# EAGLE schematic keyboardDesignV1 (EAGLE 9.3.2)
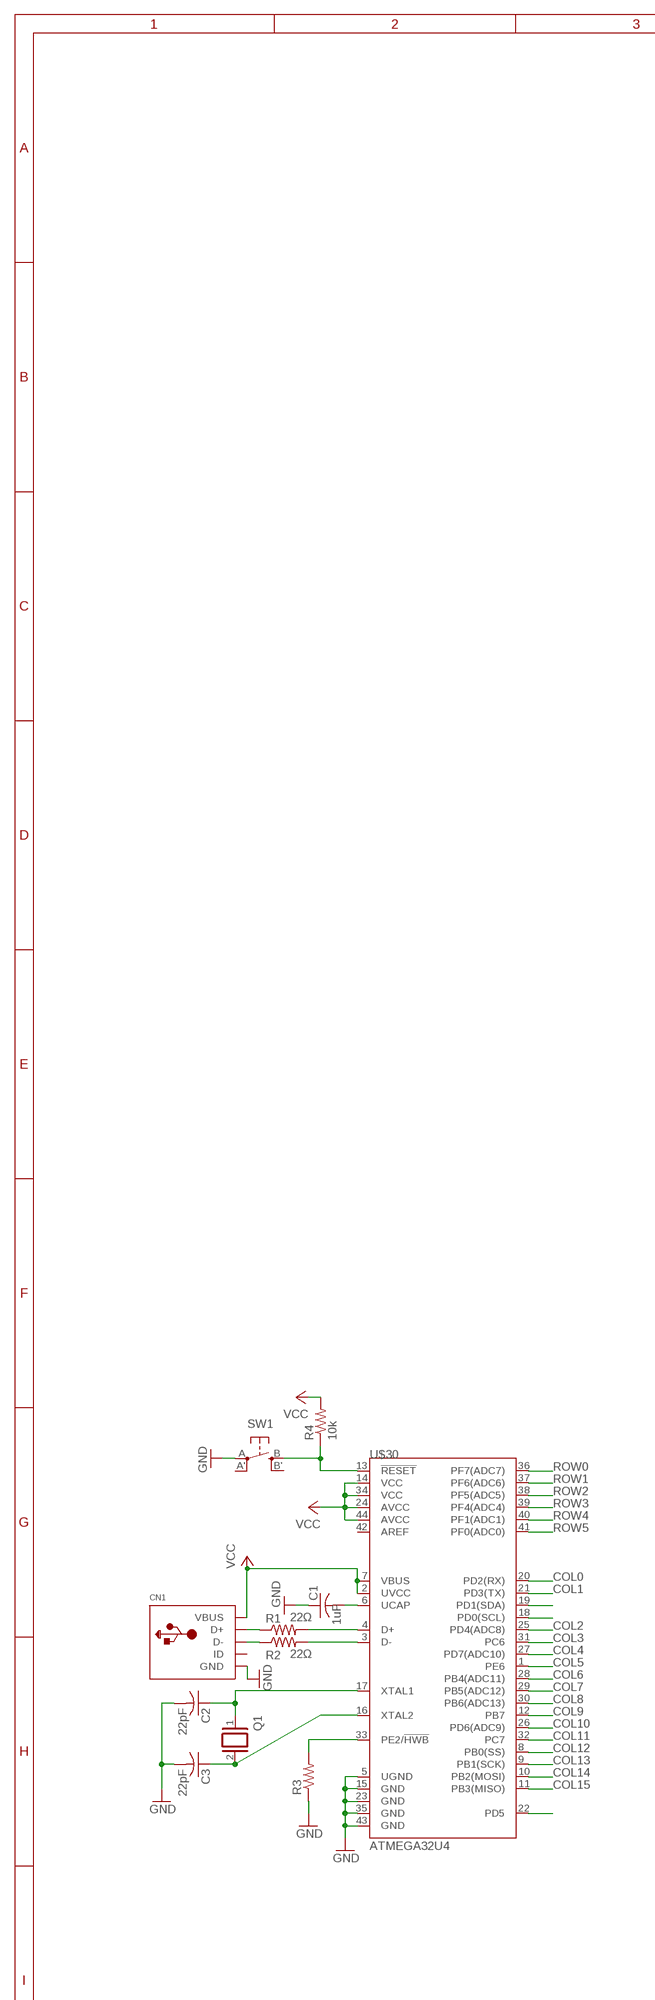
[diagram p0: schematic, sheet 1, part 1 of 2]
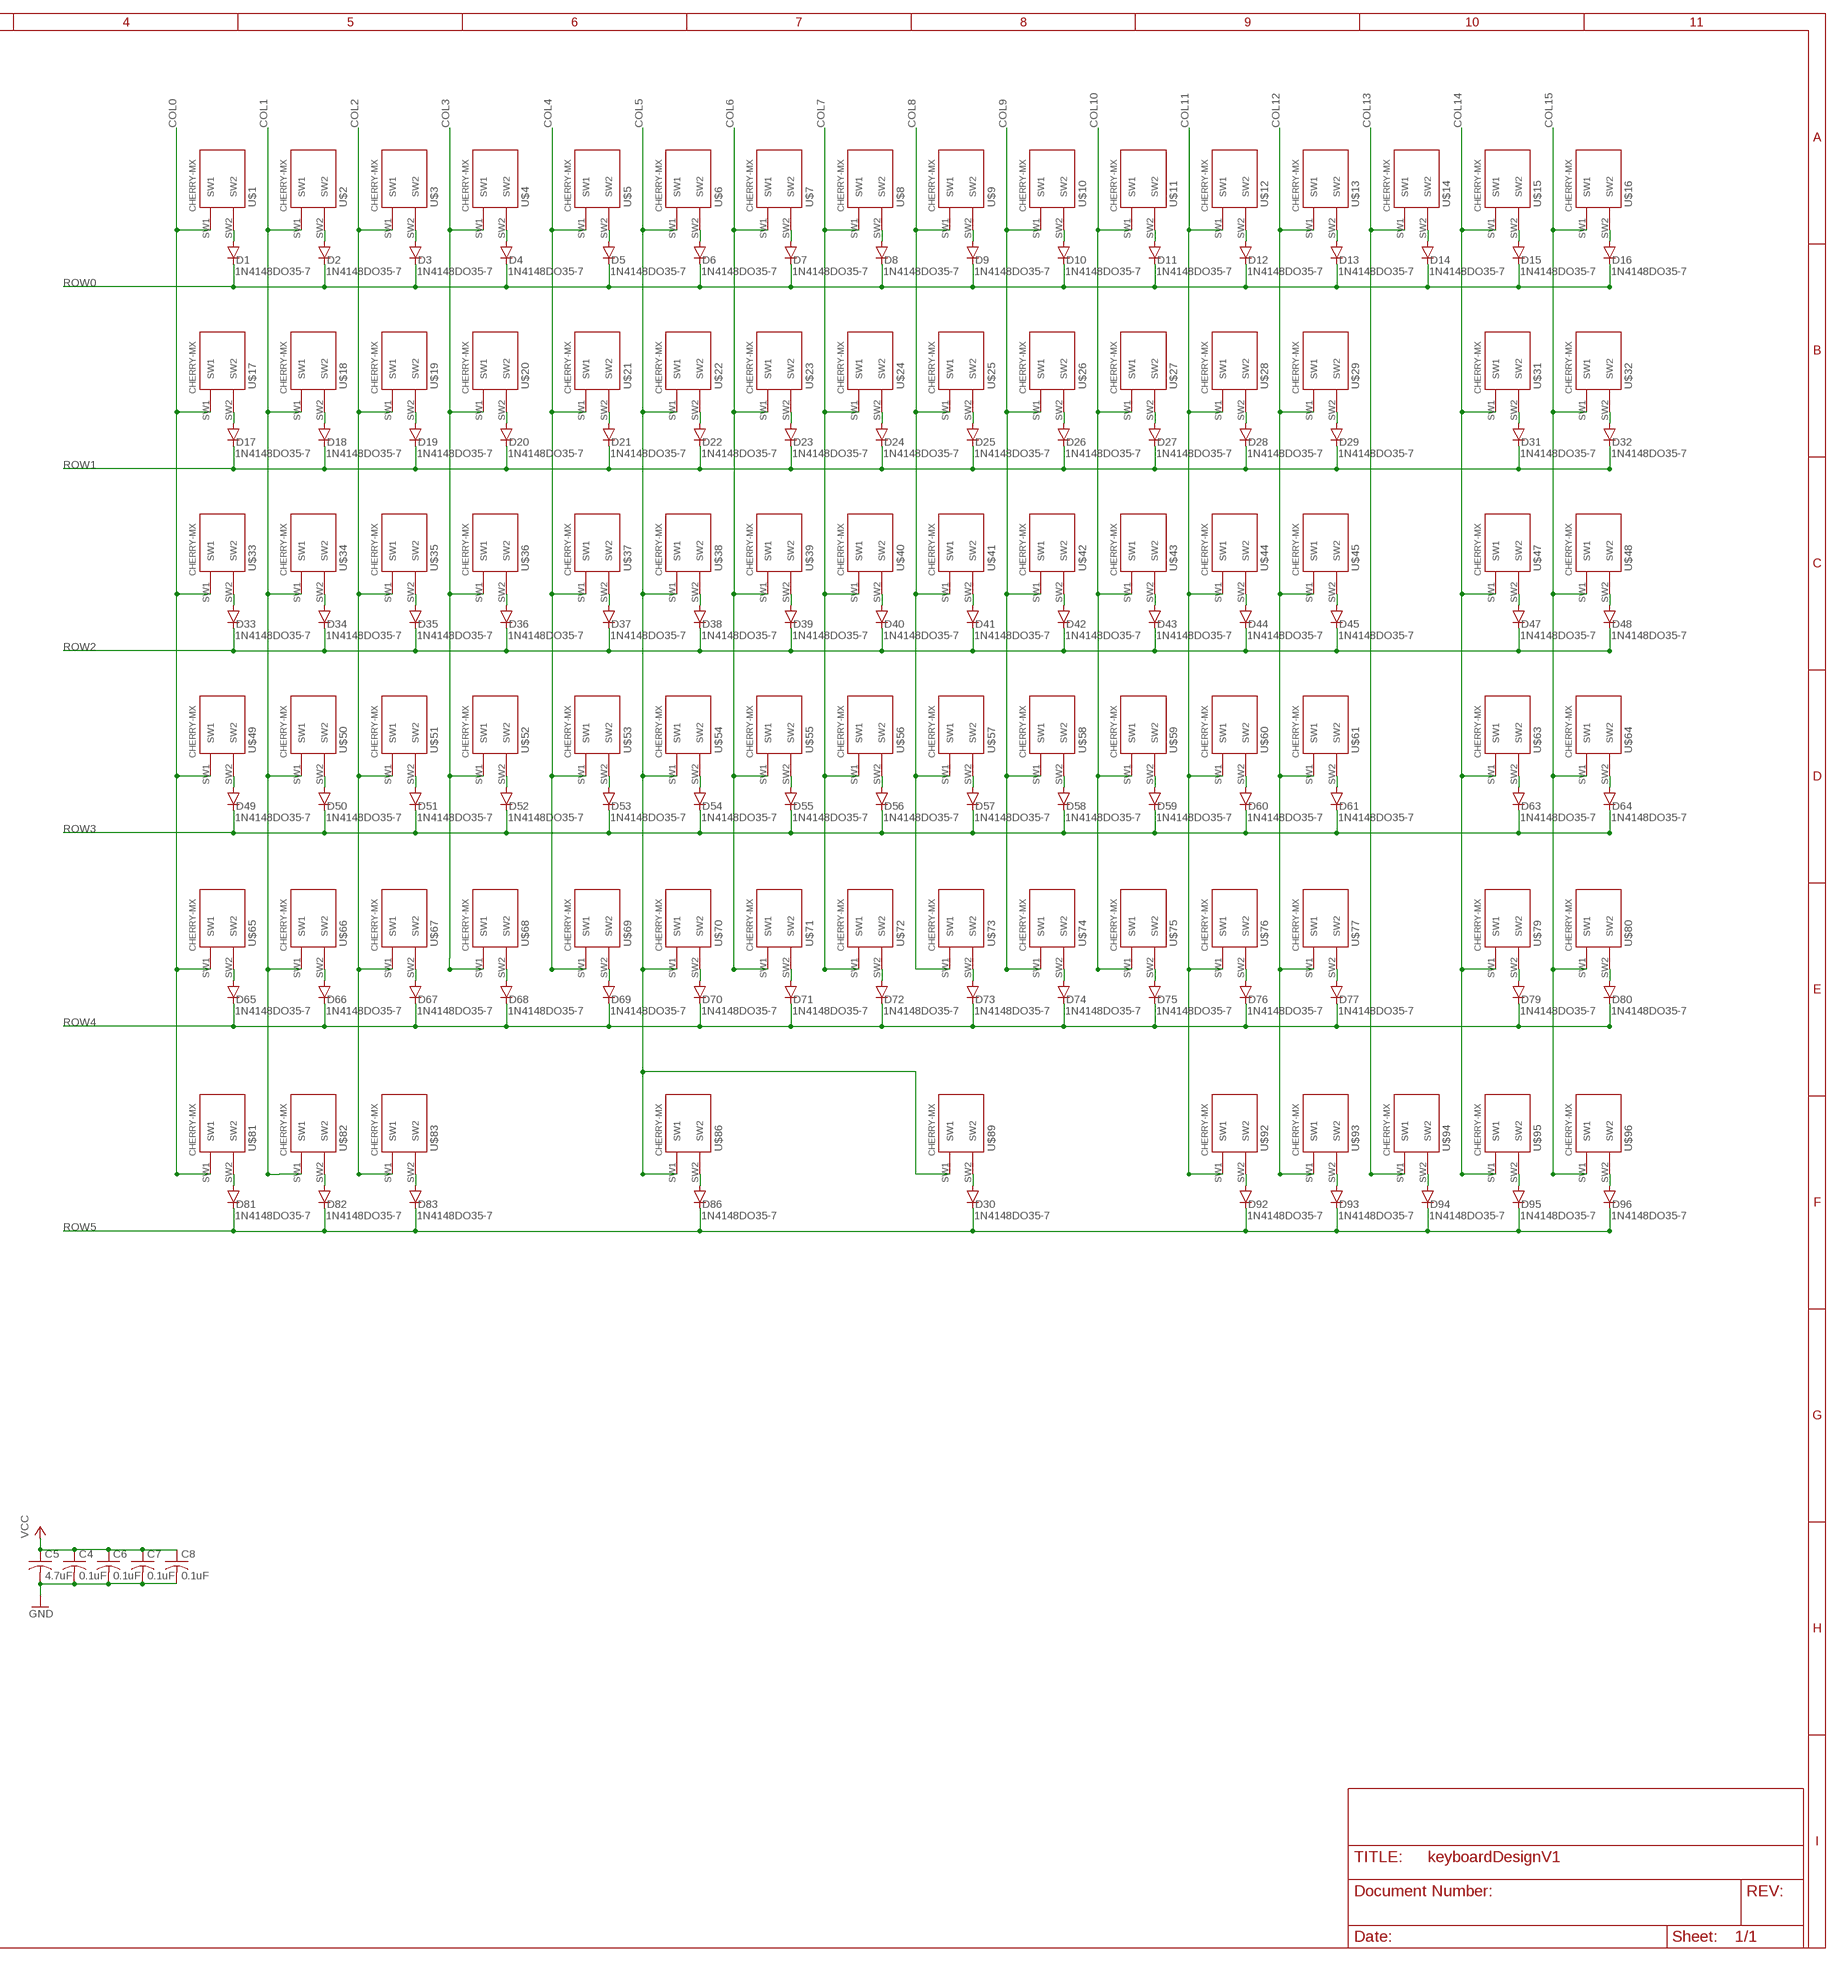
[diagram p1: schematic, sheet 1, part 2 of 2]

## Parts
C1  1uF  C-US025-025X050  [C025-025X050]
C2  22pF  C-US025-025X050  [C025-025X050]
C3  22pF  C-US025-025X050  [C025-025X050]
C4  0.1uF  C-US025-025X050  [C025-025X050]
C5  4.7uF  C-US025-025X050  [C025-025X050]
C6  0.1uF  C-US025-025X050  [C025-025X050]
C7  0.1uF  C-US025-025X050  [C025-025X050]
C8  0.1uF  C-US025-025X050  [C025-025X050]
CN1  USBTHM  [USB-MINIB-THM]
D1  1N4148DO35-7  [DO35-7]
D2  1N4148DO35-7  [DO35-7]
D3  1N4148DO35-7  [DO35-7]
D4  1N4148DO35-7  [DO35-7]
D5  1N4148DO35-7  [DO35-7]
D6  1N4148DO35-7  [DO35-7]
D7  1N4148DO35-7  [DO35-7]
D8  1N4148DO35-7  [DO35-7]
D9  1N4148DO35-7  [DO35-7]
D10  1N4148DO35-7  [DO35-7]
D11  1N4148DO35-7  [DO35-7]
D12  1N4148DO35-7  [DO35-7]
D13  1N4148DO35-7  [DO35-7]
D14  1N4148DO35-7  [DO35-7]
D15  1N4148DO35-7  [DO35-7]
D16  1N4148DO35-7  [DO35-7]
D17  1N4148DO35-7  [DO35-7]
D18  1N4148DO35-7  [DO35-7]
D19  1N4148DO35-7  [DO35-7]
D20  1N4148DO35-7  [DO35-7]
D21  1N4148DO35-7  [DO35-7]
D22  1N4148DO35-7  [DO35-7]
D23  1N4148DO35-7  [DO35-7]
D24  1N4148DO35-7  [DO35-7]
D25  1N4148DO35-7  [DO35-7]
D26  1N4148DO35-7  [DO35-7]
D27  1N4148DO35-7  [DO35-7]
D28  1N4148DO35-7  [DO35-7]
D29  1N4148DO35-7  [DO35-7]
D30  1N4148DO35-7  [DO35-7]
D31  1N4148DO35-7  [DO35-7]
D32  1N4148DO35-7  [DO35-7]
D33  1N4148DO35-7  [DO35-7]
D34  1N4148DO35-7  [DO35-7]
D35  1N4148DO35-7  [DO35-7]
D36  1N4148DO35-7  [DO35-7]
D37  1N4148DO35-7  [DO35-7]
D38  1N4148DO35-7  [DO35-7]
D39  1N4148DO35-7  [DO35-7]
D40  1N4148DO35-7  [DO35-7]
D41  1N4148DO35-7  [DO35-7]
D42  1N4148DO35-7  [DO35-7]
D43  1N4148DO35-7  [DO35-7]
D44  1N4148DO35-7  [DO35-7]
D45  1N4148DO35-7  [DO35-7]
D47  1N4148DO35-7  [DO35-7]
D48  1N4148DO35-7  [DO35-7]
D49  1N4148DO35-7  [DO35-7]
D50  1N4148DO35-7  [DO35-7]
D51  1N4148DO35-7  [DO35-7]
D52  1N4148DO35-7  [DO35-7]
D53  1N4148DO35-7  [DO35-7]
D54  1N4148DO35-7  [DO35-7]
D55  1N4148DO35-7  [DO35-7]
D56  1N4148DO35-7  [DO35-7]
D57  1N4148DO35-7  [DO35-7]
D58  1N4148DO35-7  [DO35-7]
D59  1N4148DO35-7  [DO35-7]
D60  1N4148DO35-7  [DO35-7]
D61  1N4148DO35-7  [DO35-7]
D63  1N4148DO35-7  [DO35-7]
D64  1N4148DO35-7  [DO35-7]
D65  1N4148DO35-7  [DO35-7]
D66  1N4148DO35-7  [DO35-7]
D67  1N4148DO35-7  [DO35-7]
D68  1N4148DO35-7  [DO35-7]
D69  1N4148DO35-7  [DO35-7]
D70  1N4148DO35-7  [DO35-7]
D71  1N4148DO35-7  [DO35-7]
D72  1N4148DO35-7  [DO35-7]
D73  1N4148DO35-7  [DO35-7]
D74  1N4148DO35-7  [DO35-7]
D75  1N4148DO35-7  [DO35-7]
D76  1N4148DO35-7  [DO35-7]
D77  1N4148DO35-7  [DO35-7]
D79  1N4148DO35-7  [DO35-7]
D80  1N4148DO35-7  [DO35-7]
D81  1N4148DO35-7  [DO35-7]
D82  1N4148DO35-7  [DO35-7]
D83  1N4148DO35-7  [DO35-7]
D86  1N4148DO35-7  [DO35-7]
D92  1N4148DO35-7  [DO35-7]
D93  1N4148DO35-7  [DO35-7]
D94  1N4148DO35-7  [DO35-7]
D95  1N4148DO35-7  [DO35-7]
D96  1N4148DO35-7  [DO35-7]
Q1  XTAL/S  [QS]
R1  22Ω  R-US_0204/7  [0204/7]
R2  22Ω  R-US_0204/7  [0204/7]
R3  R-US_0204/7  [0204/7]
R4  10k  R-US_0204/7  [0204/7]
SW1  SPST_TACT-EVQQ2  [EVQ-Q2]
U$1  CHERRY-MXSTANDARD  [CHERRY-MX]
U$2  CHERRY-MXSTANDARD  [CHERRY-MX]
U$3  CHERRY-MXSTANDARD  [CHERRY-MX]
U$4  CHERRY-MXSTANDARD  [CHERRY-MX]
U$5  CHERRY-MXSTANDARD  [CHERRY-MX]
U$6  CHERRY-MXSTANDARD  [CHERRY-MX]
U$7  CHERRY-MXSTANDARD  [CHERRY-MX]
U$8  CHERRY-MXSTANDARD  [CHERRY-MX]
U$9  CHERRY-MXSTANDARD  [CHERRY-MX]
U$10  CHERRY-MXSTANDARD  [CHERRY-MX]
U$11  CHERRY-MXSTANDARD  [CHERRY-MX]
U$12  CHERRY-MXSTANDARD  [CHERRY-MX]
U$13  CHERRY-MXSTANDARD  [CHERRY-MX]
U$14  CHERRY-MXSTANDARD  [CHERRY-MX]
U$15  CHERRY-MXSTANDARD  [CHERRY-MX]
U$16  CHERRY-MXSTANDARD  [CHERRY-MX]
U$17  CHERRY-MXSTANDARD  [CHERRY-MX]
U$18  CHERRY-MXSTANDARD  [CHERRY-MX]
U$19  CHERRY-MXSTANDARD  [CHERRY-MX]
U$20  CHERRY-MXSTANDARD  [CHERRY-MX]
U$21  CHERRY-MXSTANDARD  [CHERRY-MX]
U$22  CHERRY-MXSTANDARD  [CHERRY-MX]
U$23  CHERRY-MXSTANDARD  [CHERRY-MX]
U$24  CHERRY-MXSTANDARD  [CHERRY-MX]
U$25  CHERRY-MXSTANDARD  [CHERRY-MX]
U$26  CHERRY-MXSTANDARD  [CHERRY-MX]
U$27  CHERRY-MXSTANDARD  [CHERRY-MX]
U$28  CHERRY-MXSTANDARD  [CHERRY-MX]
U$29  CHERRY-MXSTANDARD  [CHERRY-MX]
U$30  ATMEGA32U4  ATMEGA32U41:1  [QFN-44-NOPAD_1:1]
U$31  CHERRY-MXSTANDARD  [CHERRY-MX]
U$32  CHERRY-MXSTANDARD  [CHERRY-MX]
U$33  CHERRY-MXSTANDARD  [CHERRY-MX]
U$34  CHERRY-MXSTANDARD  [CHERRY-MX]
U$35  CHERRY-MXSTANDARD  [CHERRY-MX]
U$36  CHERRY-MXSTANDARD  [CHERRY-MX]
U$37  CHERRY-MXSTANDARD  [CHERRY-MX]
U$38  CHERRY-MXSTANDARD  [CHERRY-MX]
U$39  CHERRY-MXSTANDARD  [CHERRY-MX]
U$40  CHERRY-MXSTANDARD  [CHERRY-MX]
U$41  CHERRY-MXSTANDARD  [CHERRY-MX]
U$42  CHERRY-MXSTANDARD  [CHERRY-MX]
U$43  CHERRY-MXSTANDARD  [CHERRY-MX]
U$44  CHERRY-MXSTANDARD  [CHERRY-MX]
U$45  CHERRY-MXSTANDARD  [CHERRY-MX]
U$47  CHERRY-MXSTANDARD  [CHERRY-MX]
U$48  CHERRY-MXSTANDARD  [CHERRY-MX]
U$49  CHERRY-MXSTANDARD  [CHERRY-MX]
U$50  CHERRY-MXSTANDARD  [CHERRY-MX]
U$51  CHERRY-MXSTANDARD  [CHERRY-MX]
U$52  CHERRY-MXSTANDARD  [CHERRY-MX]
U$53  CHERRY-MXSTANDARD  [CHERRY-MX]
U$54  CHERRY-MXSTANDARD  [CHERRY-MX]
U$55  CHERRY-MXSTANDARD  [CHERRY-MX]
U$56  CHERRY-MXSTANDARD  [CHERRY-MX]
U$57  CHERRY-MXSTANDARD  [CHERRY-MX]
U$58  CHERRY-MXSTANDARD  [CHERRY-MX]
U$59  CHERRY-MXSTANDARD  [CHERRY-MX]
U$60  CHERRY-MXSTANDARD  [CHERRY-MX]
U$61  CHERRY-MXSTANDARD  [CHERRY-MX]
U$63  CHERRY-MXSTANDARD  [CHERRY-MX]
U$64  CHERRY-MXSTANDARD  [CHERRY-MX]
U$65  CHERRY-MXSTANDARD  [CHERRY-MX]
U$66  CHERRY-MXSTANDARD  [CHERRY-MX]
U$67  CHERRY-MXSTANDARD  [CHERRY-MX]
U$68  CHERRY-MXSTANDARD  [CHERRY-MX]
U$69  CHERRY-MXSTANDARD  [CHERRY-MX]
U$70  CHERRY-MXSTANDARD  [CHERRY-MX]
U$71  CHERRY-MXSTANDARD  [CHERRY-MX]
U$72  CHERRY-MXSTANDARD  [CHERRY-MX]
U$73  CHERRY-MXSTANDARD  [CHERRY-MX]
U$74  CHERRY-MXSTANDARD  [CHERRY-MX]
U$75  CHERRY-MXSTANDARD  [CHERRY-MX]
U$76  CHERRY-MXSTANDARD  [CHERRY-MX]
U$77  CHERRY-MXSTANDARD  [CHERRY-MX]
U$79  CHERRY-MXSTANDARD  [CHERRY-MX]
U$80  CHERRY-MXSTANDARD  [CHERRY-MX]
U$81  CHERRY-MXSTANDARD  [CHERRY-MX]
U$82  CHERRY-MXSTANDARD  [CHERRY-MX]
U$83  CHERRY-MXSTANDARD  [CHERRY-MX]
U$86  CHERRY-MXSTANDARD  [CHERRY-MX]
U$89  CHERRY-MXSTANDARD  [CHERRY-MX]
U$92  CHERRY-MXSTANDARD  [CHERRY-MX]
U$93  CHERRY-MXSTANDARD  [CHERRY-MX]
U$94  CHERRY-MXSTANDARD  [CHERRY-MX]
U$95  CHERRY-MXSTANDARD  [CHERRY-MX]
U$96  CHERRY-MXSTANDARD  [CHERRY-MX]

## Nets
COL0: U$1.SW1 U$17.SW1 U$30.20(PD2(RX)) U$33.SW1 U$49.SW1 U$65.SW1 U$81.SW1
COL1: U$2.SW1 U$18.SW1 U$30.21(PD3(TX)) U$34.SW1 U$50.SW1 U$66.SW1 U$82.SW1
COL2: U$3.SW1 U$19.SW1 U$30.25(PD4(ADC8)) U$35.SW1 U$51.SW1 U$67.SW1 U$83.SW1
COL3: U$4.SW1 U$20.SW1 U$30.31(PC6) U$36.SW1 U$52.SW1 U$68.SW1
COL4: U$5.SW1 U$21.SW1 U$30.27(PD7(ADC10)) U$37.SW1 U$53.SW1 U$69.SW1
COL5: U$6.SW1 U$22.SW1 U$30.1(PE6) U$38.SW1 U$54.SW1 U$70.SW1 U$86.SW1 U$89.SW1
COL6: U$7.SW1 U$23.SW1 U$30.28(PB4(ADC11)) U$39.SW1 U$55.SW1 U$71.SW1
COL7: U$8.SW1 U$24.SW1 U$30.29(PB5(ADC12)) U$40.SW1 U$56.SW1 U$72.SW1
COL8: U$9.SW1 U$25.SW1 U$30.30(PB6(ADC13)) U$41.SW1 U$57.SW1 U$73.SW1
COL9: U$10.SW1 U$26.SW1 U$30.12(PB7) U$42.SW1 U$58.SW1 U$74.SW1
COL10: U$11.SW1 U$27.SW1 U$30.26(PD6(ADC9)) U$43.SW1 U$59.SW1 U$75.SW1
COL11: U$12.SW1 U$28.SW1 U$30.32(PC7) U$44.SW1 U$60.SW1 U$76.SW1 U$92.SW1
COL12: U$13.SW1 U$29.SW1 U$30.8(PB0(SS)) U$45.SW1 U$61.SW1 U$77.SW1 U$93.SW1
COL13: U$14.SW1 U$30.9(PB1(SCK)) U$94.SW1
COL14: U$15.SW1 U$30.10(PB2(MOSI)) U$31.SW1 U$47.SW1 U$63.SW1 U$79.SW1 U$95.SW1
COL15: U$16.SW1 U$30.11(PB3(MISO)) U$32.SW1 U$48.SW1 U$64.SW1 U$80.SW1 U$96.SW1
GND: C1.1 C2.2 C3.2 C4.2 C5.2 C6.2 C7.2 C8.2 CN1.GND R3.1 SW1.A(P) U$30.5(UGND) U$30.15(GND) U$30.23(GND) U$30.35(GND) U$30.43(GND)
N$1: D1.A U$1.SW2
N$2: D30.A U$89.SW2
N$3: D17.A U$17.SW2
N$4: D2.A U$2.SW2
N$5: C1.2 U$30.6(UCAP)
N$6: R1.2 U$30.4(D+)
N$7: D3.A U$3.SW2
N$8: CN1.D+ R1.1
N$9: D18.A U$18.SW2
N$10: D4.A U$4.SW2
N$11: R2.2 U$30.3(D-)
N$12: CN1.D- R2.1
N$13: D5.A U$5.SW2
N$14: C2.1 Q1.1 U$30.17(XTAL1)
N$15: D19.A U$19.SW2
N$16: D6.A U$6.SW2
N$17: C3.1 Q1.2 U$30.16(XTAL2)
N$18: R3.2 U$30.33(PE2/!HWB)
N$19: D7.A U$7.SW2
N$20: R4.1 SW1.B(S) U$30.13(!RESET)
N$21: D20.A U$20.SW2
N$22: D8.A U$8.SW2
N$25: D9.A U$9.SW2
N$27: D21.A U$21.SW2
N$28: D10.A U$10.SW2
N$31: D11.A U$11.SW2
N$33: D22.A U$22.SW2
N$34: D12.A U$12.SW2
N$37: D13.A U$13.SW2
N$38: U$30.19(PD1(SDA))
N$39: D23.A U$23.SW2
N$40: D14.A U$14.SW2
N$41: U$30.18(PD0(SCL))
N$43: D15.A U$15.SW2
N$45: D24.A U$24.SW2
N$46: D16.A U$16.SW2
N$49: D25.A U$25.SW2
N$51: D26.A U$26.SW2
N$53: D27.A U$27.SW2
N$55: D28.A U$28.SW2
N$57: D29.A U$29.SW2
N$61: D31.A U$31.SW2
N$63: D32.A U$32.SW2
N$65: D33.A U$33.SW2
N$67: D34.A U$34.SW2
N$68: U$30.22(PD5)
N$69: D35.A U$35.SW2
N$71: D36.A U$36.SW2
N$73: D37.A U$37.SW2
N$75: D38.A U$38.SW2
N$77: D39.A U$39.SW2
N$79: D40.A U$40.SW2
N$81: D41.A U$41.SW2
N$83: D42.A U$42.SW2
N$85: D43.A U$43.SW2
N$87: D44.A U$44.SW2
N$89: D45.A U$45.SW2
N$93: D47.A U$47.SW2
N$95: D48.A U$48.SW2
N$97: D49.A U$49.SW2
N$99: D50.A U$50.SW2
N$101: D51.A U$51.SW2
N$103: D52.A U$52.SW2
N$105: D53.A U$53.SW2
N$107: D54.A U$54.SW2
N$109: D55.A U$55.SW2
N$111: D56.A U$56.SW2
N$113: D57.A U$57.SW2
N$115: D58.A U$58.SW2
N$117: D59.A U$59.SW2
N$119: D60.A U$60.SW2
N$121: D61.A U$61.SW2
N$125: D63.A U$63.SW2
N$127: D64.A U$64.SW2
N$129: D65.A U$65.SW2
N$131: D66.A U$66.SW2
N$133: D67.A U$67.SW2
N$135: D68.A U$68.SW2
N$137: D69.A U$69.SW2
N$139: D70.A U$70.SW2
N$141: D71.A U$71.SW2
N$143: D72.A U$72.SW2
N$145: D73.A U$73.SW2
N$147: D74.A U$74.SW2
N$149: D75.A U$75.SW2
N$151: D76.A U$76.SW2
N$153: D77.A U$77.SW2
N$157: D79.A U$79.SW2
N$159: D80.A U$80.SW2
N$161: D81.A U$81.SW2
N$163: D82.A U$82.SW2
N$165: D83.A U$83.SW2
N$177: D86.A U$86.SW2
N$183: D92.A U$92.SW2
N$185: D93.A U$93.SW2
N$187: D94.A U$94.SW2
N$189: D95.A U$95.SW2
N$191: D96.A U$96.SW2
ROW0: D1.C D2.C D3.C D4.C D5.C D6.C D7.C D8.C D9.C D10.C D11.C D12.C D13.C D14.C D15.C D16.C U$30.36(PF7(ADC7))
ROW1: D17.C D18.C D19.C D20.C D21.C D22.C D23.C D24.C D25.C D26.C D27.C D28.C D29.C D31.C D32.C U$30.37(PF6(ADC6))
ROW2: D33.C D34.C D35.C D36.C D37.C D38.C D39.C D40.C D41.C D42.C D43.C D44.C D45.C D47.C D48.C U$30.38(PF5(ADC5))
ROW3: D49.C D50.C D51.C D52.C D53.C D54.C D55.C D56.C D57.C D58.C D59.C D60.C D61.C D63.C D64.C U$30.39(PF4(ADC4))
ROW4: D65.C D66.C D67.C D68.C D69.C D70.C D71.C D72.C D73.C D74.C D75.C D76.C D77.C D79.C D80.C U$30.40(PF1(ADC1))
ROW5: D30.C D81.C D82.C D83.C D86.C D92.C D93.C D94.C D95.C D96.C U$30.41(PF0(ADC0))
VCC: C4.1 C5.1 C6.1 C7.1 C8.1 CN1.VBUS R4.2 U$30.2(UVCC) U$30.7(VBUS) U$30.14(VCC) U$30.24(AVCC) U$30.34(VCC) U$30.44(AVCC)
Unconnected: CN1.ID SW1.A'(P1) SW1.B'(S1) U$30.42(AREF)

## Library data of the parts
C1-C8 = rcl:C-US: CAPACITOR, American symbol; SPICEPREFIX: C
CN1 = adafruit:USB: USB Connectors USBMINIB - Surface Mount Female Mini-B USB Connector 4UConnector: 06564 By microbuilder.eu Thru-hole RA Female Mini-B USB Connector 4UConnector: 18732 By ladyada.net
D1-D45 D47-D61 D63-D77 D79-D83 D86 D92-D96 = diode:1N4148: DIODE high speed (Philips)
Q1 = special:XTAL/S: CRYSTAL
R1-R4 = resistor:R-US_: RESISTOR, American symbol
SW1 = adafruit:SPST_TACT: SMT 6mm switch, EVQQ2 series http://www.ladyada.net/library/eagle
U$1-U$29 U$31-U$45 U$47-U$61 U$63-U$77 U$79-U$83 U$86 U$89 U$92-U$96 = cherrymx:CHERRY-MX: Cherry MX series keyswitch
U$30 = SparkFun-IC-Microcontroller:ATMEGA32U4: Atmel MCU, 32KByte Atmel 44-pin 8-bit Microcontroller with 32KBytes of ISP Flash and USB Controller Datasheet <http://cdn.sparkfun.com/datasheets/Dev/Arduino/Boards/ATMega32U4.pdf> SparkFun Products LilyPad Arduino USB - ATmega32U4 Board <https://www.sparkfun.com/products/12049> (DEV-12049) Pro Micro - 5V/16MHz <https://www.sparkfun.com/products/12640> (DEV-12640) Pro Micro - 3.3V/8MHz <https://www.sparkfun.com/products/12587> (DEV-12587) Fio v3 - ATmega32U4 <https://www.sparkfun.com/products/11520> (DEV-11520) Qduino Mini <https://www.sparkfun.com/products/13614> (DEV-13614) Makey Makey - Standard Kit <https://www.sparkfun.com/products/11511> (WIG-11511) Makey Makey Deluxe Kit <https://www.sparkfun.com/products/11519> (WIG-11519); PROD_ID: IC-10828; VALUE: 32U4